# EAGLE design core (EAGLE 6.4)
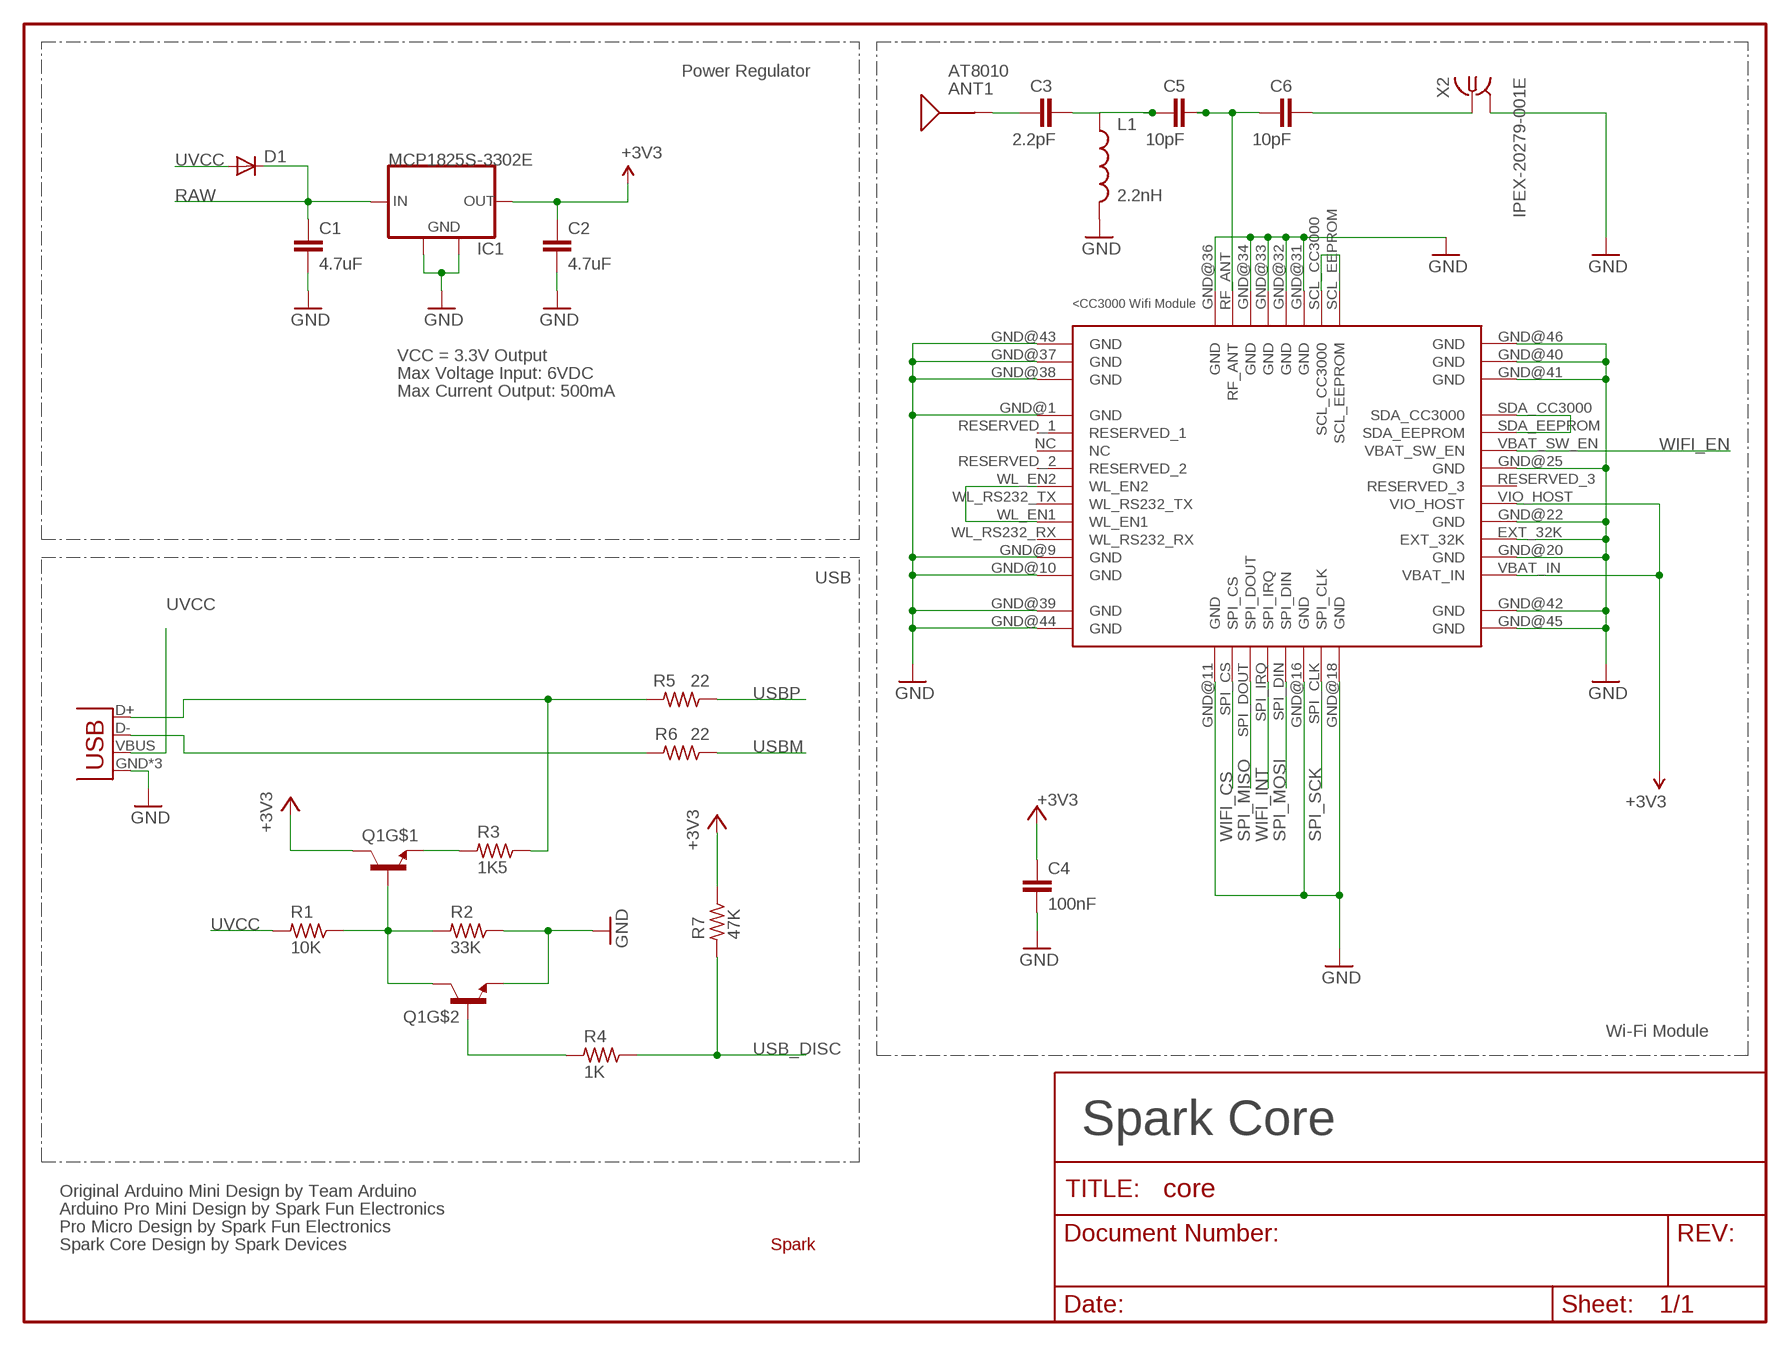
[diagram p0: schematic, sheet 1, part 1 of 2]
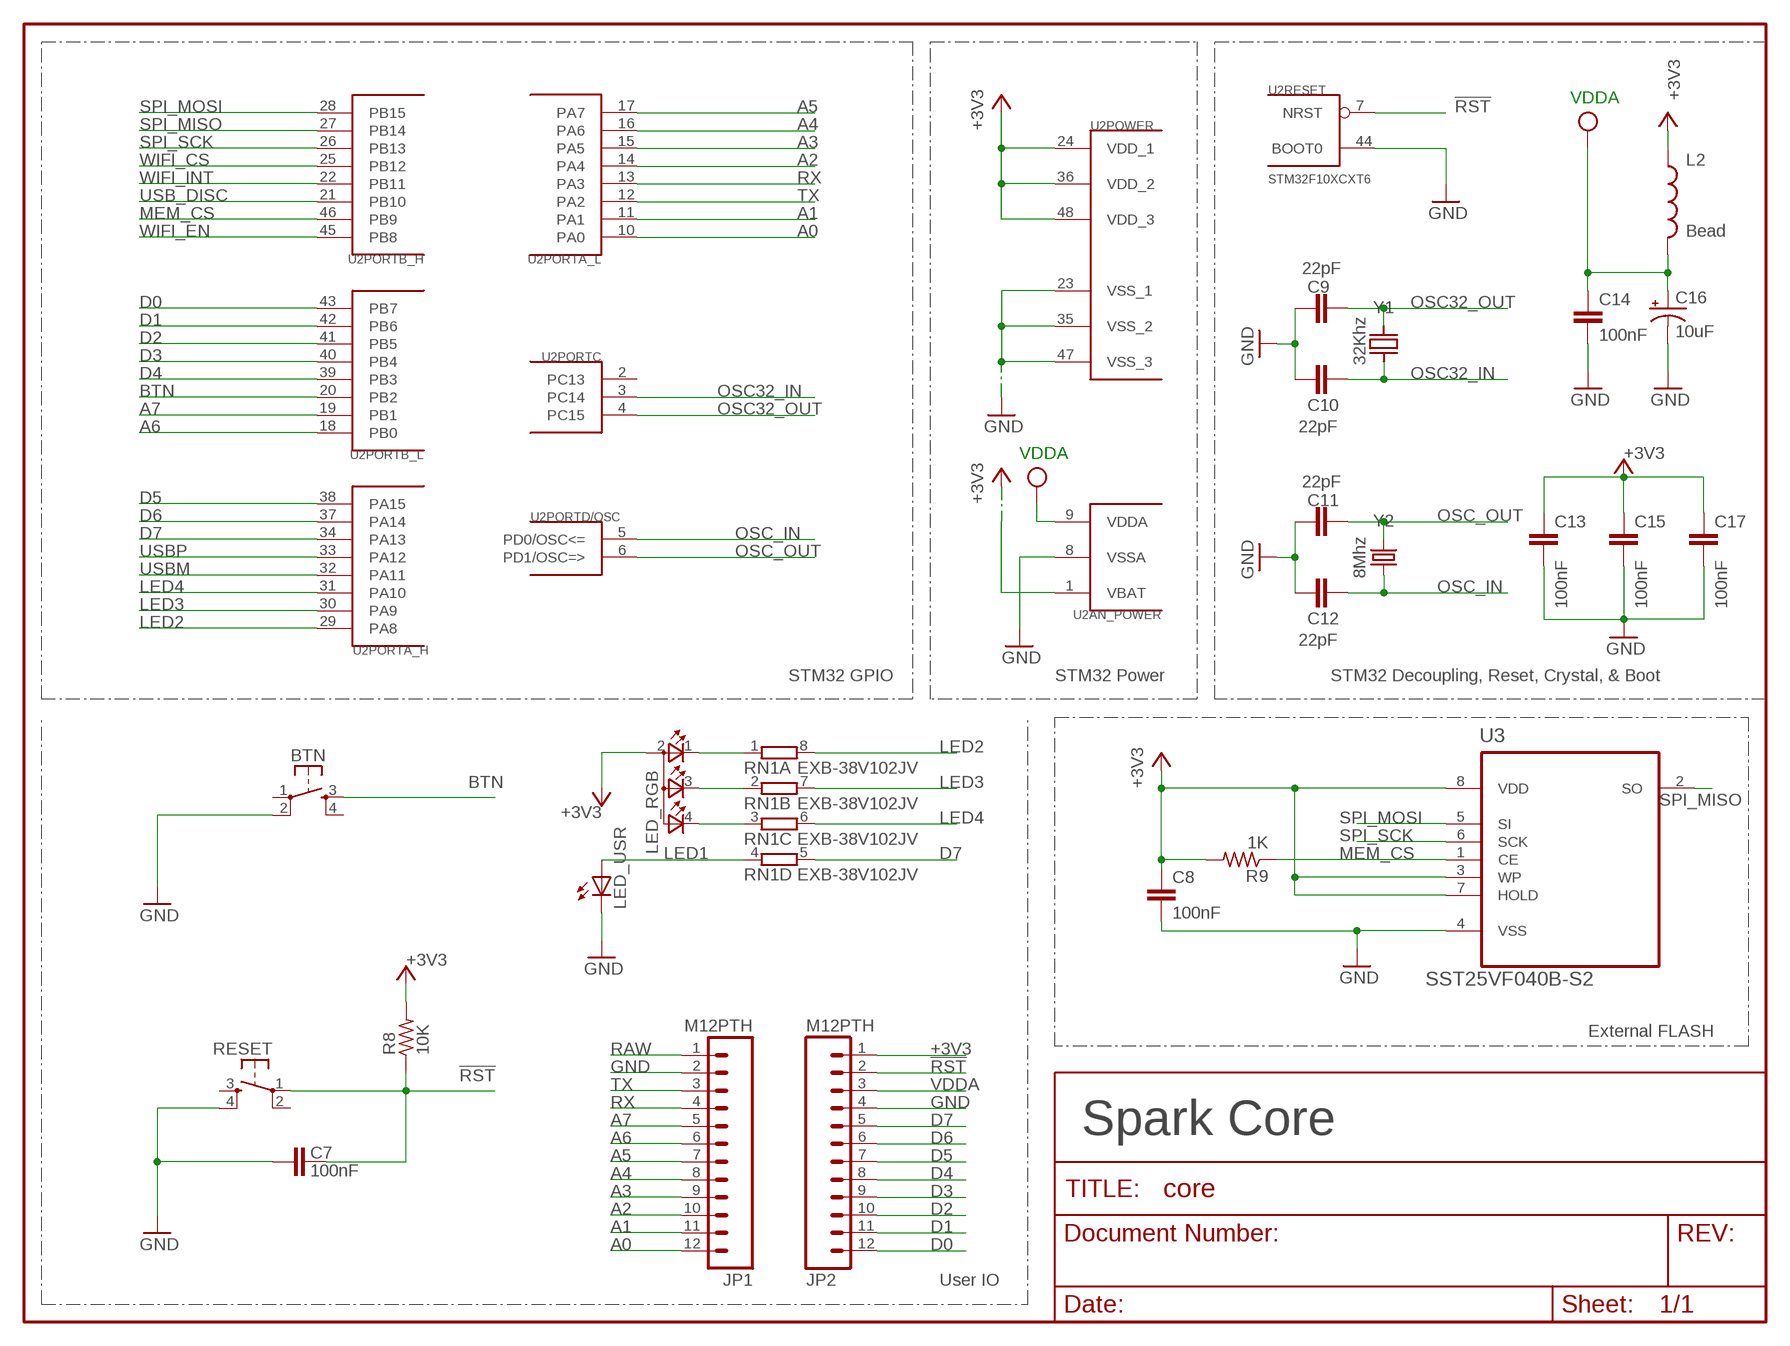
[diagram p1: schematic, sheet 1, part 2 of 2]

## Parts
ANT1  AT8010  [AT8010]
BTN  KMR211GLFS  TAC_SWITCHSMD  [TACTILE_SWITCH_SMD]
C1  4.7uF  C-EUC0603  [C0603]
C2  4.7uF  C-EUC0603  [C0603]
C3  2.2pF  C-EUC0603  [C0603]
C4  100nF  C-EUC0603  [C0603]
C5  10pF  C-EUC0603  [C0603]
C6  10pF  C-EUC0603  [C0603]
C7  100nF  C-EUC0603  [C0603]
C8  100nF  C-EUC0603  [C0603]
C9  22pF  C-EUC0603  [C0603]
C10  22pF  C-EUC0603  [C0603]
C11  22pF  C-EUC0603  [C0603]
C12  22pF  C-EUC0603  [C0603]
C13  100nF  C-EUC0603  [C0603]
C14  100nF  C-EUC0603  [C0603]
C15  100nF  C-EUC0603  [C0603]
C16  10uF  TANT-CAP1206  [EIA3216]
C17  100nF  C-EUC0603  [C0603]
D1  DIODESOD  [SOD-323]
IC1  MCP1825S-3302E  MCP1825S-SOT223  [SOT223]
JP1  M12PTH  [1X12-SMALL-PADS]
JP2  M12PTH  [1X12-SMALL-PADS]
L1  2.2nH  INDUCTOR0603  [0603]
L2  Bead  INDUCTOR0603  [0603]
LED_RGB  TOPLED-3PLCC  [P-LCC-4-3]
LED_USR  LED0603  [LED-0603]
Q1  MMDT3904  [SOT363]
R1  10K  R-US_R0603  [R0603]
R2  33K  R-US_R0603  [R0603]
R3  1K5  R-US_R0603  [R0603]
R4  1K  R-US_R0603  [R0603]
R5  22  R-US_R0603  [R0603]
R6  22  R-US_R0603  [R0603]
R7  47K  R-US_R0603  [R0603]
R8  10K  R-US_R0603  [R0603]
R9  1K  R-US_R0603  [R0603]
RESET  KMR211GLFS  TAC_SWITCHSMD  [TACTILE_SWITCH_SMD]
RN1  EXB-38V102JV  4R-NEXB38V  [EXB38V]
U1  CC3000  [CC3000]
U2  STM32F10XCXT6  [TQFP48]
U3  SST25VF040B-S2  [SOIC127P790X216-8N]
U$1  SPARK_LOGO2  [SPARK_LOGO2]
X1  USB-MICROB  USBUSB-MICROB-SLOT-HOLE  [USB-MICROB-SLOT-HOLE]
X2  IPEX-20279-001E  [IPEX-20279-001E]
Y1  32Khz  Q_FC135  [FC135]
Y2  8Mhz  CRYSTAL5X3  [CRYSTAL-SMD-5X3]

## Nets
!RST: C7.2 JP2.2 R8.1 RESET.1 U2.7(RESET:NRST)
+3V3: C2.1 C4.1 C8.1 C13.1 C15.1 C17.1 IC1.3(OUT) JP2.1 L2.1 LED_RGB.2(A2) Q1.3(C) R7.1 R8.2 R9.2 U1.VBAT_IN U1.VIO_HOST U2.1(AN_POWER:VBAT) U2.24(POWER:VDD_1) U2.36(POWER:VDD_2) U2.48(POWER:VDD_3) U3.3(WP) U3.7(HOLD) U3.8(VDD)
A0: JP1.12 U2.10(PORTA_L:PA0)
A1: JP1.11 U2.11(PORTA_L:PA1)
A2: JP1.10 U2.14(PORTA_L:PA4)
A3: JP1.9 U2.15(PORTA_L:PA5)
A4: JP1.8 U2.16(PORTA_L:PA6)
A5: JP1.7 U2.17(PORTA_L:PA7)
A6: JP1.6 U2.18(PORTB_L:PB0)
A7: JP1.5 U2.19(PORTB_L:PB1)
BTN: BTN.3 U2.20(PORTB_L:PB2)
D0: JP2.12 U2.43(PORTB_L:PB7)
D1: JP2.11 U2.42(PORTB_L:PB6)
D2: JP2.10 U2.41(PORTB_L:PB5)
D3: JP2.9 U2.40(PORTB_L:PB4)
D4: JP2.8 U2.39(PORTB_L:PB3)
D5: JP2.7 U2.38(PORTA_H:PA15)
D6: JP2.6 U2.37(PORTA_H:PA14)
D7: JP2.5 RN1.5 U2.34(PORTA_H:PA13)
GND [vcc]: BTN.2 C1.2 C2.2 C4.2 C7.1 C8.2 C9.2 C10.2 C11.2 C12.2 C13.2 C14.2 C15.2 C16.C(-) C17.2 IC1.2(GND) IC1.4(GND) JP1.2 JP2.4 L1.2 LED_USR.C Q1.1(E) R2.1 RESET.4 U1.EXT_32K U1.GND@1(GND) U1.GND@9(GND) U1.GND@10(GND) U1.GND@11(GND) U1.GND@16(GND) U1.GND@18(GND) U1.GND@20(GND) U1.GND@22(GND) U1.GND@25(GND) U1.GND@31(GND) U1.GND@32(GND) U1.GND@33(GND) U1.GND@34(GND) U1.GND@36(GND) U1.GND@37(GND) U1.GND@38(GND) U1.GND@39(GND) U1.GND@40(GND) U1.GND@41(GND) U1.GND@42(GND) U1.GND@43(GND) U1.GND@44(GND) U1.GND@45(GND) U1.GND@46(GND) U2.8(AN_POWER:VSSA) U2.23(POWER:VSS_1) U2.35(POWER:VSS_2) U2.44(RESET:BOOT0) U2.47(POWER:VSS_3) U3.4(VSS) X1.GND X1.MT1(GND) X1.MT2(GND) X2.2@1(GND) X2.2@2(GND)
LED1: LED_USR.A RN1.4
LED2: RN1.8 U2.29(PORTA_H:PA8)
LED3: RN1.7 U2.30(PORTA_H:PA9)
LED4: RN1.6 U2.31(PORTA_H:PA10)
MEM_CS: R9.1 U2.46(PORTB_H:PB9) U3.1(CE)
N$1: R3.1 R5.2 X1.D+
N$2 [RF]: C6.2 X2.1
N$3 [RF]: ANT1.SIG(SIGNAL) C3.1
N$4 [RF]: C5.2 C6.1 U1.RF_ANT
N$5 [RF]: C3.2 C5.1 L1.1
N$6: R6.2 X1.D-
N$7: U1.SCL_CC3000 U1.SCL_EEPROM
N$8: Q1.2(B) R4.2
N$9: U1.WL_EN1 U1.WL_EN2
N$10: LED_RGB.1(CRED) RN1.1
N$12: LED_RGB.3(CBLUE) RN1.2
N$13: Q1.5(B) Q1.6(C) R1.1 R2.2
N$14: LED_RGB.4(CGREEN) RN1.3
N$15: U1.SDA_CC3000 U1.SDA_EEPROM
N$16: Q1.4(E) R3.2
OSC32_IN: C10.1 U2.3(PORTC:PC14) Y1.X1
OSC32_OUT: C9.1 U2.4(PORTC:PC15) Y1.X2
OSC_IN: C12.1 U2.5(PORTD/OSC:PD0/OSC<=) Y2.1
OSC_OUT: C11.1 U2.6(PORTD/OSC:PD1/OSC=>) Y2.3
RAW [vcc]: C1.1 D1.1(C) IC1.1(IN) JP1.1
RX: JP1.4 U2.13(PORTA_L:PA3)
SPI_MISO: U1.SPI_DOUT U2.27(PORTB_H:PB14) U3.2(SO)
SPI_MOSI: U1.SPI_DIN U2.28(PORTB_H:PB15) U3.5(SI)
SPI_SCK: U1.SPI_CLK U2.26(PORTB_H:PB13) U3.6(SCK)
TX: JP1.3 U2.12(PORTA_L:PA2)
USB_DISC: R4.1 R7.2 U2.21(PORTB_H:PB10)
USBM: R6.1 U2.32(PORTA_H:PA11)
USBP: R5.1 U2.33(PORTA_H:PA12)
UVCC: D1.2(A) R1.2 X1.VBUS
VDDA: C14.1 C16.A(+) JP2.3 L2.2 U2.9(AN_POWER:VDDA) ; supply symbol labelled VCC
WIFI_CS: U1.SPI_CS U2.25(PORTB_H:PB12)
WIFI_EN: U1.VBAT_SW_EN U2.45(PORTB_H:PB8)
WIFI_INT: U1.SPI_IRQ U2.22(PORTB_H:PB11)
Unconnected: BTN.1 BTN.4 RESET.2 RESET.3 U1.NC U1.RESERVED_1 U1.RESERVED_2 U1.RESERVED_3 U1.WL_RS232_RX U1.WL_RS232_TX U2.2(PORTC:PC13)

## Notes on the sheet
- Power Regulator
- VDDA
- VCC = 3.3V Output
- Max Voltage Input: 6VDC
- Max Current Output: 500mA
- VDDA
- USB
- STM32 GPIO | STM32 Power | STM32 Decoupling, Reset, Crystal, & Boot
- Wi-Fi Module | External FLASH
- Spark Core | Spark Core
- Original Arduino Mini Design by Team Arduino
- Arduino Pro Mini Design by Spark Fun Electronics
- Pro Micro Design by Spark Fun Electronics
- Spark Core Design by Spark Devices
- User IO

## Library data of the parts
ANT1 = Spark:AT8010: AT8010 Series Multilayer Chip Antenna
BTN RESET = Spark:TAC_SWITCH: SMD Tactiile Switch
C1-C15 C17 = rcl:C-EU: CAPACITOR, European symbol
C16 = Spark:TANT-CAP: Tantalum SMT
D1 = SparkFun:DIODE: Diode These are standard reverse protection diodes and small signal diodes. SMA package can handle up to about 1A. SOD-323 can handle about 200mA. What the SOD-323 package when ordering, there are some mfgs out there that are 5-pin packages.
IC1 = Spark:MCP1825S: 500 mA, Low Voltage, Low Quiescent Current LDO Regulator
JP1 JP2 = Spark:M12: Header 12 Standard 12-pin 0.1" header. Use with straight break away headers (SKU : PRT-00116), right angle break away headers (PRT-00553), swiss pins (PRT-00743), machine pins (PRT-00117), and female headers (PRT-00115).
L1 L2 = SparkFun-Passives:INDUCTOR: Inductors Basic Inductor/Choke - 0603 and 1206. Footprints are not proven and vary greatly between part numbers. SRN6045- 33uH, 20% 1.4A
LED_RGB = Spark:TOPLED-3: Cree CLVBA-FKA
LED_USR = SparkFun:LED: LEDs Standard schematic elements and footprints for 5mm, 3mm, 1206, and 0603 sized LEDs. 5mm - Spark Fun Electronics SKU : COM-00529 (and others)
Q1 = SparkFun-DiscreteSemi:MMDT3904: Dual NPN transistor
R1-R9 = rcl:R-US_: RESISTOR, American symbol
RN1 = resistor-dil:4R-N: Array Chip Resistor Source: RS Component / Phycomp; OC_FARNELL: unknown; OC_NEWARK: unknown
U1 = CC3000:CC3000
U2 = stm32:STM32F10XCXT6: ST STM32F101/103 48pin LQFP
U3 = Spark:SST25VF040B: 4 Mbit SPI Serial Flash
U$1 = Spark:SPARK_LOGO2
X1 = Spark:USB
X2 = Spark:IPEX-20279-001E: Ultra Miniature Coaxial SMT RF Receptacle
Y1 = Spark:Q
Y2 = SparkFun-FreqCtrl:CRYSTAL: Various standard crystals. Proven footprints. Spark Fun Electronics SKU : COM-00534

## Net classes
2 RF: width 0.635 mm, clearance 0.762 mm

## Board
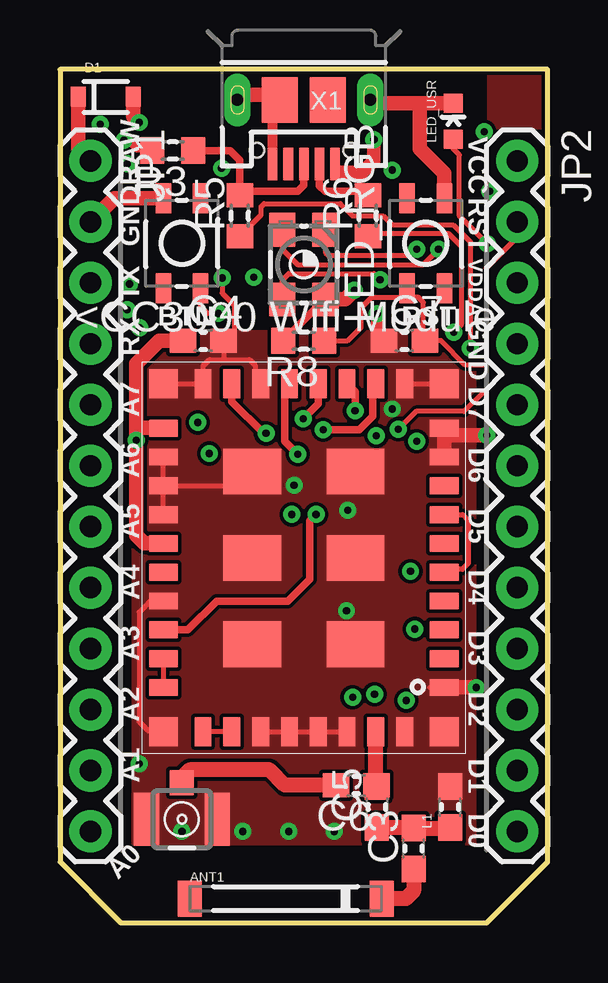
[diagram p2: board, top side]
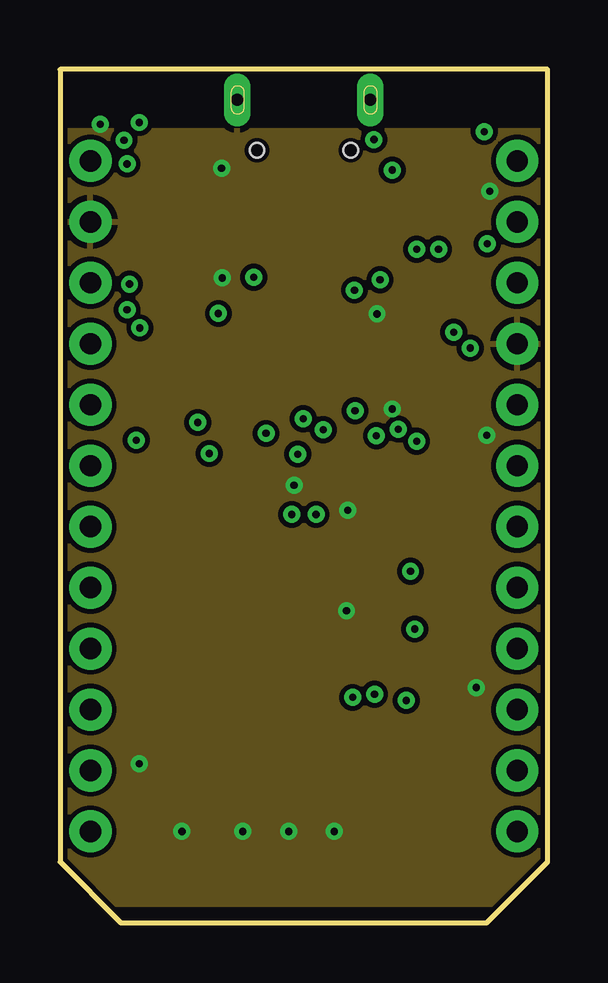
[diagram p3: board, inner layer $GND]
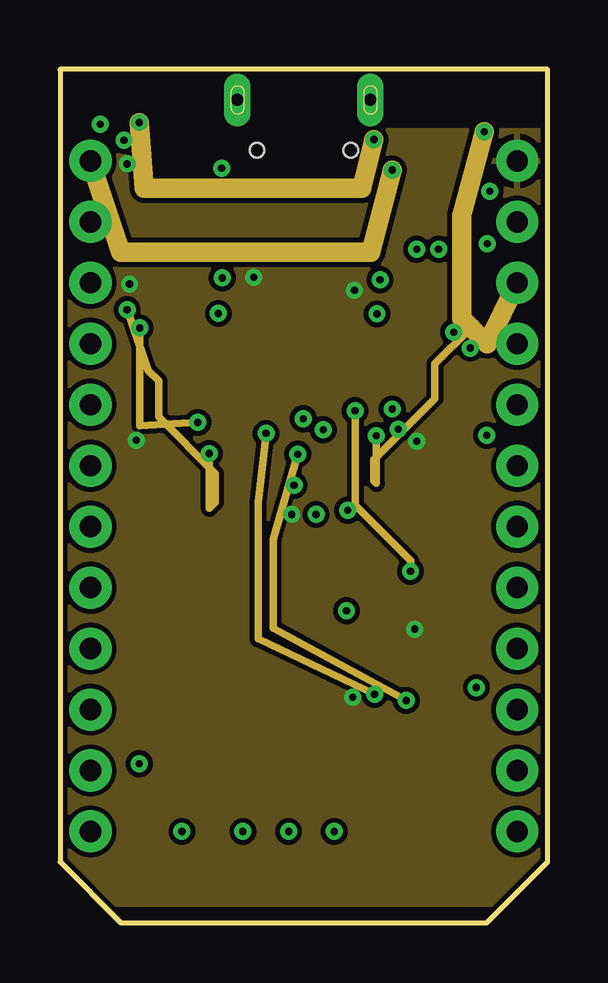
[diagram p4: board, inner layer $+3V3]
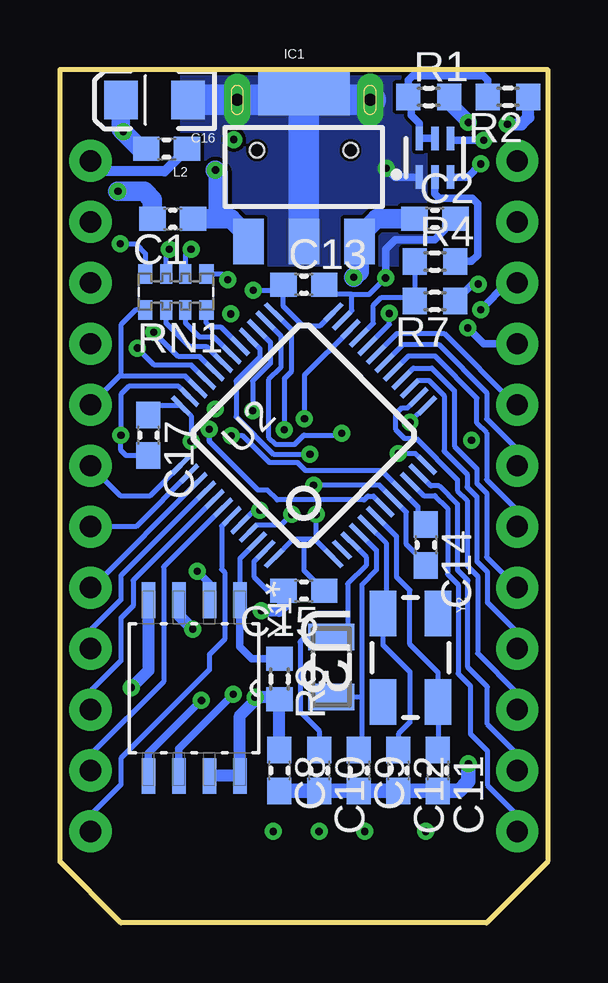
[diagram p5: board, bottom side, seen from below]

Size 20.32 x 35.56 mm. Coordinates in mm from the lower left corner, seen from the top.
Outline: 0,35.56 0,2.54 2.54,0 17.78,0 20.32,2.54 20.32,35.56 0,35.56
Copper layers (1+2*15+16): Top 0.035mm / dielectric 1.5mm / $GND 0.035mm / dielectric 0.15mm / $+3V3 0.035mm / dielectric 0.2mm / Bottom 0.035mm
Design rules "spark": minimum track width 6mil, minimum drill 0.3mm, track to track 6mil, track to pad 6mil, pad to pad 6mil, via to via 6mil, smd to smd 6mil, copper to edge 6mil, drill to drill 6mil, minimum pad ring 12mil, minimum via ring 8mil, stop-mask expansion 4mil, vias tented up to drill 20mil, thermal gap 10mil

### Footprints (pad centres in the part's own frame; a part is rotated, then mirrored left to right if it is on the bottom)
AT8010 = smd 1 x 1.5: NC -4,0; SIG 4,0
TACTILE_SWITCH_SMD = smd 1.25 x 0.65: 1 -1.875,0.775; 2 1.875,0.775; 3 -1.875,-0.775; 4 1.875,-0.775
C0603 = smd 1.1 x 1: 1 -0.85,0; 2 0.85,0
EIA3216 = smd 1.4 x 1.6: A 1.4,0; C -1.4,0
SOD-323 = smd 0.63 x 0.83: 1 -1.15,0; 2 1.15,0
SOT223 = smd 1.27 x 1.905: 1 -2.311,-3.099; 2 0,-3.099; 3 2.311,-3.099 | smd 3.81 x 1.905: 4 0,3.099
1X12-SMALL-PADS = drill 0.889 pad 1.753: 1 0,0; 2 2.54,0; 3 5.08,0; 4 7.62,0; 5 10.16,0; 6 12.7,0; 7 15.24,0; 8 17.78,0; 9 20.32,0; 10 22.86,0; 11 25.4,0; 12 27.94,0
0603 = smd 1.1 x 1: 1 -0.85,0; 2 0.85,0
P-LCC-4-3 = smd 1.1 x 1.4: 1 -0.9,-1.45; 2 0.9,-1.45; 3 0.9,1.45; 4 -0.9,1.45
LED-0603 = smd 0.8 x 0.8: A 0,-0.75; C 0,0.75
SOT363 = smd 0.3 x 0.99: 1 -0.65,-0.8; 2 0,-0.8; 3 0.65,-0.8; 4 0.65,0.81; 5 0,0.81; 6 -0.65,0.81
R0603 = smd 1 x 1.1: 1 -0.85,0; 2 0.85,0
EXB38V = smd 0.6 x 0.8: 1 -1.275,-0.75; 4 1.275,-0.75; 5 1.275,0.75; 8 -1.275,0.75 | smd 0.5 x 0.8: 2 -0.4,-0.75; 3 0.4,-0.75; 6 0.4,0.75; 7 -0.4,0.75
CC3000 = smd 1.2 x 0.7: EXT_32K 5.85,-2.97; GND@1 -5.85,5.43; GND@9 -5.85,-4.17; GND@10 -5.85,-5.37; GND@20 5.85,-4.17; GND@22 5.85,-1.77; GND@25 5.85,1.83; NC -5.85,3.03; RESERVED_1 -5.85,4.23; RESERVED_2 -5.85,1.83; RESERVED_3 5.85,0.63; SDA_CC3000 5.85,5.43; SDA_EEPROM 5.85,4.23; VBAT_IN 5.85,-5.37; VBAT_SW_EN 5.85,3.03; VIO_HOST 5.85,-0.57; WL_EN1 -5.85,-1.77; WL_EN2 -5.85,0.63; WL_RS232_RX -5.85,-2.97; WL_RS232_TX -5.85,-0.57 | smd 0.7 x 1.2: GND@11 -4.2,-7.22; GND@16 1.8,-7.22; GND@18 4.2,-7.22; GND@31 1.8,7.28; GND@32 0.6,7.28; GND@33 -0.6,7.28; GND@34 -1.8,7.28; GND@36 -4.2,7.28; RF_ANT -3,7.28; SCL_CC3000 3,7.28; SCL_EEPROM 4.2,7.28; SPI_CLK 3,-7.22; SPI_CS -3,-7.22; SPI_DIN 0.6,-7.22; SPI_DOUT -1.8,-7.22; SPI_IRQ -0.6,-7.22 | smd 2.4 x 1.9: GND@37 -2.15,3.63; GND@38 -2.15,0.03; GND@39 -2.15,-3.57; GND@40 2.15,3.63; GND@41 2.15,0.03; GND@42 2.15,-3.57 | smd 1.2 x 1.2: GND@43 -5.85,7.28; GND@44 -5.85,-7.22; GND@45 5.85,-7.22; GND@46 5.85,7.28
TQFP48 = smd 0.2 x 1: 1 -2.75,-4.5; 2 -2.25,-4.5; 3 -1.75,-4.5; 4 -1.25,-4.5; 5 -0.75,-4.5; 6 -0.25,-4.5; 7 0.25,-4.5; 8 0.75,-4.5; 9 1.25,-4.5; 10 1.75,-4.5; 11 2.25,-4.5; 12 2.75,-4.5; 25 2.75,4.5; 26 2.25,4.5; 27 1.75,4.5; 28 1.25,4.5; 29 0.75,4.5; 30 0.25,4.5; 31 -0.25,4.5; 32 -0.75,4.5; 33 -1.25,4.5; 34 -1.75,4.5; 35 -2.25,4.5; 36 -2.75,4.5 | smd 1 x 0.2: 13 4.5,-2.75; 14 4.5,-2.25; 15 4.5,-1.75; 16 4.5,-1.25; 17 4.5,-0.75; 18 4.5,-0.25; 19 4.5,0.25; 20 4.5,0.75; 21 4.5,1.25; 22 4.5,1.75; 23 4.5,2.25; 24 4.5,2.75; 37 -4.5,2.75; 38 -4.5,2.25; 39 -4.5,1.75; 40 -4.5,1.25; 41 -4.5,0.75; 42 -4.5,0.25; 43 -4.5,-0.25; 44 -4.5,-0.75; 45 -4.5,-1.25; 46 -4.5,-1.75; 47 -4.5,-2.25; 48 -4.5,-2.75
SOIC127P790X216-8N = smd 1.499 x 0.559: 1 -3.658,1.905; 2 -3.658,0.635; 3 -3.658,-0.635; 4 -3.658,-1.905; 5 3.658,-1.905; 6 3.658,-0.635; 7 3.658,0.635; 8 3.658,1.905
USB-MICROB-SLOT-HOLE = smd 0.4 x 1.35: D+ 0,2.675; D- -0.65,2.675; GND 1.3,2.675; ID 0.65,2.675; VBUS -1.3,2.675 | drill 0.5 pad 1.1 long: MT1 -2.775,0; MT2 2.775,0 | smd 1.5 x 1.9: P$1 -1,0; P$2 1,0.01 | hole 0.6: -1.95,2.1; 1.95,2.1
IPEX-20279-001E = smd 1 x 1.05: 1 0,1.528 | smd 1.05 x 2.2: 2@1 -1.475,0; 2@2 1.475,0
FC135 = smd 1.1 x 1.9: X1 -1.25,0; X2 1.25,0
CRYSTAL-SMD-5X3 = smd 1.9 x 1.1: 1 -1.85,-1.15; 2 1.85,-1.15; 3 1.85,1.15; 4 -1.85,1.15

### Placement (x,y rotation side)
ANT1  9.4,1.02 0 top
BTN  5.08,28.32 90 top
C1  15.62,29.34 180 bottom
C2  4.7,29.34 0 bottom
C3  14.73,3.1 90 top
C4  5.97,24.26 0 top
C5  13.21,4.83 90 top
C6  12.34,5.74 180 top
C7  14.35,24.26 0 top
C8  11.18,6.35 270 bottom
C9  7.87,6.35 270 bottom
C10  9.53,6.35 270 bottom
C11  4.57,6.35 270 bottom
C12  6.22,6.35 270 bottom
C13  10.16,26.59 0 bottom
C14  5.08,15.75 270 bottom
C15  10.16,13.84 180 bottom
C16  16.38,34.29 180 bottom
C17  16.64,20.32 270 bottom
D1  1.91,34.42 0 top
IC1  10.16,31.5 0 bottom
JP1  1.27,31.75 270 top
JP2  19.05,31.75 270 top
L1  16.26,4.83 90 top
L2  15.88,32.26 180 bottom
LED_RGB  10.16,27.43 0 top
LED_USR  16.38,33.4 0 top
Q1  4.7,31.88 0 bottom
R1  4.95,34.42 0 bottom
R2  1.65,34.42 180 bottom
R3  4.7,32.18 180 top
R4  4.7,27.56 0 bottom
R5  7.49,29.46 90 top
R6  12.83,29.46 90 top
R7  4.7,25.91 180 bottom
R8  10.16,24.26 180 top
R9  11.18,10.16 270 bottom
RESET  15.24,28.32 90 top
RN1  15.49,26.29 180 bottom
U1  10.16,15.24 180 top
U2  10.16,20.32 45 bottom
U3  14.73,9.78 270 bottom
U$1  17.78,33.02 0 top
X1  10.16,34.29 180 top
X2  5.08,4.32 0 top
Y1  9.02,10.67 270 bottom
Y2  5.71,11.05 270 bottom

### Tracks (layer width: path | path; a pad name or v marks a point on that pad's centre or on a via)
!RST  (via drill 0.3)
  Top 0.203: 17.75,24.08 17.75,27.28 19.05,28.57 JP2.2 | 17.75,24.08 17.75,23.24 | 17.75,23.24 17.75,22.23 16.84,21.31 14.83,21.31 v14.1,20.57 | 17.73,24.11 17.75,24.08 | R8.1 11.99,24.26 12.55,24.82 12.55,25.63 12.98,26.06 14.46,26.06 | 14.46,26.06 14.94,26.06 15.14,25.86 15.14,24.32 C7.2 15.88,24.26 16.89,23.24 17.75,23.24 | 14.46,26.06 RESET.1 | 17.78,23.24 17.75,23.24
  Bottom 0.203: 14.1,20.17 v14.1,20.57 14.1,20.07 12.06,18.03 11.68,18.03 11.28,17.63 7.64,17.63 7.49,17.78 7.27,17.78 U2.7
+3V3  (via drill 0.3)
  Top 0.305: R8.2 11.04,25.98 LED_RGB.2
  Top 0.61: U1.VIO_HOST 3.52,15.81 3.17,16.15 v3.17,20.12 3.17,20.62 | 3.17,20.62 3.17,23.29 4.14,24.26 C4.1 | U1.VBAT_IN 4.29,20.62 3.17,20.62 | LED_RGB.2 11.88,25.98 v12.27,26.36
  Bottom 0.203: U2.1 9.71,15.98 | 9.71,15.98 10.16,15.98 | 10.16,15.98 10.62,15.98 U2.48 | 10.16,15.98 10.16,14.69 C15.1 | U2.24 9.5,24.87 10.19,24.87 11.01,25.69 C13.1 11.24,26.36 v12.27,26.36 | C17.1 16.25,21.56 U2.36 14.86,21.13 v14.86,20.07 | 9.71,15.98 9.65,16.03 v9.65,17.02
  Bottom 0.305: R7.1 3.14,26.62 v2.9,26.62 | Q1.3 3.34,31.08 v2.79,31.62
  Bottom 0.406: L2.1 15.96,31.32 18.62,31.32 JP2.1
  Bottom 0.508: U3.7 U3.8 12.83,8.64 12.19,9.27 v12.19,9.4 11.6,9.4 11.34,9.14 R9.2 C8.1 | v14.78,12.24 15.37,12.83 U3.3
  Bottom 0.813: C2.1 7.11,29.34 7.85,28.6 IC1.3 7.85,27.13 v8.08,26.9
  pour $+3V3 (isolate 0.203): 0,33.02 20.32,33.02 20.32,0.76 0,0.76
A0
  Bottom 0.203: U2.10 5.17,17.8 4.7,17.8 4.17,17.27 4.17,14.53 3.73,14.1 3.73,10.39 3.23,9.88 3.23,7.87 2.52,7.16 2.52,5.74 1.27,4.5 JP1.12
A1
  Bottom 0.203: U2.11 4.87,18.21 4.52,18.21 3.76,17.45 3.76,14.71 3.33,14.28 3.33,10.64 2.52,9.83 2.52,8.28 1.27,7.04 JP1.11
A2
  Bottom 0.203: JP1.10 1.27,9.58 2.92,11.23 2.92,14.45 3.35,14.88 3.35,17.6 3.76,18.01 3.76,18.47 5.49,20.19 5.97,20.19 6.35,20.57 6.35,21.18 6.07,21.46 5.84,21.46 U2.14
A3
  Bottom 0.203: U2.15 5.4,22.61 4.95,22.61 4.32,21.97 4.32,19.66 3.35,18.69 3.35,18.16 2.95,17.75 2.95,15.06 2.52,14.63 2.52,13.36 1.27,12.12 JP1.9
A4
  Bottom 0.203: U2.16 5.6,23.11 4.83,23.11 3.89,22.17 3.89,19.86 2.95,18.92 2.95,18.31 2.54,17.91 2.54,15.24 JP1.8
A5
  Bottom 0.203: U2.17 5.8,23.62 4.7,23.62 2.95,21.87 2.95,20.83 2.54,20.42 2.54,18.47 1.27,17.2 JP1.7
A6
  Bottom 0.203: U2.18 6.02,24.11 4.55,24.11 2.54,22.1 2.54,21.01 1.27,19.74 JP1.6
A7
  Bottom 0.203: U2.19 6.27,24.56 4.32,24.56 1.35,21.59 JP1.5
BTN  (via drill 0.3)
  Top 0.203: 5.84,26.43 BTN.3 5.87,26.43 5.87,25.65 6.13,25.39 v6.6,25.39
  Bottom 0.203: U2.20 6.6,24.94 v6.6,25.39
D0
  Bottom 0.203: JP2.12 19.05,4.5 17.78,5.77 17.78,6.86 14.1,10.54 14.1,11.18 13.46,11.81 13.46,14.61 13.59,14.73 13.59,16.54 U2.43
D1
  Bottom 0.203: U2.42 16,14.83 16,10.06 19.05,7.01 JP2.11
D2
  Bottom 0.203: U2.41 17.27,14.27 17.27,13.21 17.78,12.7 17.78,10.92 19.05,9.65 JP2.10
D3
  Bottom 0.203: U2.40 17.77,14.48 17.78,14.48 17.78,13.46 19.05,12.19 JP2.9
D4
  Bottom 0.203: U2.39 18.98,13.97 JP2.8
D5
  Bottom 0.203: U2.38 17.15,16.51 JP2.7
D6
  Bottom 0.203: U2.37 16.59,17.78 17.78,17.78 JP2.6
D7
  Bottom 0.203: U2.34 15.1,22.78 17.86,22.78 | RN1.5 17.16,25.54 17.78,24.92 17.78,22.86 17.86,22.78 | 17.86,22.78 JP2.5
GND  (via drill 0.3)
  Top 0.203: U1.GND@43 16.01,8.12 | U1.GND@1 15.4,9.81 | U1.GND@34 U1.GND@33 U1.GND@32 U1.GND@31 8.36,8.4 | U1.GND@22 U1.EXT_32K | U1.GND@45 U1.GND@18 | U1.GND@38 12.41,15.11 | U1.GND@25 4.49,13.59 3.94,13.59 3.3,12.95 3.3,8.38 3.68,8 4.27,8 U1.GND@46 | U1.GND@11 U1.GND@44 | U1.EXT_32K U1.GND@20 | U1.EXT_32K 7.41,18.21 U1.GND@42 | U1.GND@18 | 8.26,21.97 8.26,22.36 U1.GND@16 8.13,22.69 8.13,23.24 7.9,23.47 6.83,23.47 | U1.GND@18 5.96,23.21 6.22,23.47 6.83,23.47 | 6.83,23.47 6.82,23.48 C4.2 7.26,24.7 7.26,25.73 6.76,26.24 v6.76,26.87 | 12.06,17.27 12.06,17.4
  Top 0.406: X1.GND 8.86,34.51
  Top 0.508: v13.21,25.38 13.21,24.55 C7.1
  Top 0.61: U1.GND@1 v17.34,9.81 v17.35,9.8 | U1.GND@9 U1.GND@10 16.3,20.32 v17.78,20.32 | RESET.4 16.02,31.23 14.99,32.26 14.99,34.15 | LED_USR.C 14.99,34.15 | 14.99,34.15 13.07,34.15 X1.MT1 | BTN.2 2.26,30.2 JP1.2 | 8.86,34.51 7.61,34.51 X1.MT2
  Bottom 0.203: U2.35 15.37,22.35 17.45,22.35 17.78,22.02 v17.78,20.32 17.78,19.68 17.57,19.47 C17.2 | U2.47 12.24,15.05 12.24,14.43 11.66,13.84 C15.2 | 8.15,26.19 7.44,26.19 v6.76,26.87 | U2.23 8.15,25.51 8.15,26.19 | C14.2 5.08,14.96 5.89,15.77 5.89,17.11 U2.8 7.02,18.24 v9.75,18.24 | 8.15,26.19 8.9,26.19 C13.2 | U2.44 12.22,17.2 v11.99,17.2
  Bottom 0.305: 10.16,34.67 IC1.4 | Q1.1 6.36,31.08 v6.73,31.45 | C2.2 4.71,28.47 6.35,28.47 6.76,28.07 v6.76,26.87
  Bottom 0.508: U3.4 16.64,10.52 v17.35,9.8 | v11.94,13.01 11.2,13.01 11.01,13.2 C15.2 | v1.68,33.27 1.09,33.27 0.8,33.56 R2.1 0.81,34.41
  Bottom 0.61: C8.2 C10.2 C9.2 C12.2 C11.2 3.69,5.5 3.3,5.89 v3.3,6.63
  Bottom 0.813: C1.2 16.47,30.14 16.82,30.48 v17.91,30.48 | 10.16,34.8 IC1.4
  Bottom 1.27: IC1.2 IC1.4 | 7.37,34.29 X1.MT1 C16.C
  other vias: 5.08,3.81 7.62,3.81 9.53,3.81 11.43,3.81 13.84,21.41
  pour $GND (isolate 0.203): 0,33.02 20.32,33.02 20.32,0.76 0,0.76
  pour Top (no thermals): 3.05,3.3 3.05,24.64 17.27,24.64 17.27,3.3
  pour Bottom (no thermals): 5.08,35.56 15.24,35.56 15.24,27.43 5.08,27.43
LED1  (via drill 0.3)
  Top 0.203: v17.8,28.3 16.64,29.46 16.64,32 16.38,32.26 LED_USR.A
  Bottom 0.203: v17.8,28.3 17.17,28.3 16.76,27.89 RN1.4
LED2
  Bottom 0.203: U2.29 13.6,24.82 14.05,24.82 14.22,24.99 RN1.8
LED3
  Bottom 0.203: U2.30 13.9,24.41 14.5,24.41 15.09,24.99 RN1.7
LED4
  Bottom 0.203: U2.31 14.2,24 14.91,24 15.9,24.99 RN1.6
MEM_CS
  Bottom 0.203: U2.46 12.83,15.18 U3.1
  Bottom 0.305: U3.1 12.83,11.51 12.33,11.01 R9.1
N$1
  Top 0.305: R3.1 7.09,32.18 7.49,31.77 R5.2 7.66,30.48 9.91,30.48 10.16,30.73 X1.D+
N$2
  Top 0.635: C6.2 9.37,5.74 8.74,6.38 5.4,6.38 5.08,6.06 X2.1
N$3
  Top 0.635: C3.1 14.73,1.33 14.41,1.02 ANT1.SIG
N$4
  Top 0.406: 13.21,5.74 C6.1
  Top 0.635: C6.1 13.16,5.78 U1.RF_ANT | 13.21,5.74 C5.2
N$5
  Top 0.635: C5.1 14.71,3.98 C3.2 16.23,3.95 L1.1
N$6
  Top 0.305: X1.D- 10.81,30.72 11.05,30.48 12.66,30.48 R6.2
N$7
  Top 0.203: U1.SCL_CC3000 U1.SCL_EEPROM
N$8
  Bottom 0.305: Q1.2 4.7,30.38 4.52,30.2 3.15,30.2 2.92,29.97 2.92,27.81 3.17,27.56 R4.2
N$9
  Top 0.203: U1.WL_EN1 16.77,17.01 17.02,16.76 17.02,14.99 16.76,14.73 16.13,14.73 U1.WL_EN2
N$10  (via drill 0.3)
  Top 0.203: LED_RGB.1 9.26,26.79 9.53,27.05 13.08,27.05 v13.34,26.8
  Bottom 0.203: RN1.1 13.58,27.04 v13.34,26.8
N$11
  pour Top: 17.91,35.56 20.32,35.56 20.32,33.15 17.91,33.15
N$12  (via drill 0.3)
  Top 0.203: LED_RGB.3 11.06,27.93 11.18,27.81 14.61,27.81 v14.86,28.07
  Bottom 0.203: v14.86,28.07 15.09,27.83 RN1.2
N$13
  Bottom 0.305: Q1.5 Q1.6 5.35,33.31 5.69,33.66 5.69,34.3 R1.1 5.8,35.12 5.61,35.31 2.69,35.31 2.5,35.12 R2.2
N$14  (via drill 0.3)
  Top 0.203: LED_RGB.4 9.26,28.08 9.91,27.43 15.14,27.43 v15.77,28.07
  Bottom 0.203: RN1.3 15.89,27.95 v15.77,28.07
N$15
  Top 0.203: U1.SDA_EEPROM U1.SDA_CC3000
N$16  (via drill 0.3)
  Top 0.305: 3.76,32.18 R3.2 3.77,32.26 3.2,32.26 2.85,32.61 v2.67,32.61
  Bottom 0.305: Q1.4 3.98,32.61 v2.67,32.61
OSC32_IN
  Bottom 0.203: U2.3 7.57,15.25 7.57,14.88 8.33,14.12 8.33,12.27 8.43,12.17 8.77,12.17 Y1.X1 10.1,11.92 10.31,11.71 10.31,8.79 9.53,8 C10.1
OSC32_OUT
  Bottom 0.203: U2.4 7.14,15.53 7.14,14.71 7.75,14.1 7.75,9.42 | 7.75,9.42 7.75,7.33 C9.1 | Y1.X2 7.75,9.42
OSC_IN
  Bottom 0.203: U2.5 6.73,15.83 6.73,13.03 Y2.1 6.87,11.59 5.74,10.46 5.74,8.36 6.22,7.87 C12.1
OSC_OUT
  Bottom 0.203: U2.6 6.3,16.11 6.3,14.43 5.74,13.87 5.74,11.61 4.57,10.43 Y2.3 | 4.57,9.21 Y2.3 | Y2.3 C11.1
RAW  (via drill 0.3)
  Top 0.61: D1.1 0.76,32.27 JP1.1
  $+3V3 0.813: v13.84,31.37 12.95,27.94 2.54,27.94 JP1.1
  Bottom 0.813: IC1.1 12.47,28.6 13.21,29.34 13.72,29.34 | 13.72,29.34 C1.1 | v13.84,31.37 13.72,31.24 13.72,29.34
RX  (via drill 0.3)
  $+3V3 0.305: v3.33,24.79 3.33,20.72 v5.74,20.85
  Bottom 0.203: U2.13 v5.74,20.85
  Bottom 0.305: v3.33,24.79 2.67,24.13 JP1.4
SPI_MISO  (via drill 0.3)
  Top 0.305: U1.SPI_DOUT 12.29,22.13 v12.29,21.34
  $+3V3 0.305: v12.29,21.34 12.29,17.4 14.61,15.09 v14.61,14.66
  Bottom 0.203: U2.27 11.56,24.19 11.56,23.32 12.29,22.58 v12.29,21.34
  Bottom 0.305: U3.2 14.1,14.15 v14.61,14.66
SPI_MOSI  (via drill 0.3)
  Top 0.305: U1.SPI_DIN 9.37,22.27 9.37,20.07 v9.91,19.53
  $+3V3 0.305: v14.43,9.27 8.89,12.27 8.89,15.98 v9.91,19.53
  Bottom 0.203: U2.28 11.99,23.92 11.99,23.57 12.98,22.58 12.98,21.08 11.43,19.53 v9.91,19.53
  Bottom 0.305: U3.5 16.64,7.06 v14.43,9.27
SPI_SCK  (via drill 0.3)
  Top 0.305: U1.SPI_CLK 7.16,21.72 8.48,20.4 v8.59,20.4
  $+3V3 0.305: v13.11,9.53 8.26,11.84 8.26,17.53 v8.59,20.4
  Bottom 0.203: U2.26 11.12,24.47 11.12,23.14 11.63,22.63 11.63,20.24 11.33,19.94 10.54,19.94 10.16,20.32 8.66,20.32 v8.59,20.4
  Bottom 0.305: U3.6 15.37,7.26 v13.11,9.53
TX  (via drill 0.3)
  $+3V3 0.305: v2.79,25.55 3.68,23.01 4.12,22.58 4.12,21.08 6.48,18.72 6.48,17.53 6.22,17.27 v6.22,19.56
  Bottom 0.203: U2.12 5.51,19.56 v6.22,19.56
  Bottom 0.305: v2.79,25.55 1.68,26.67 JP1.3
USB_DISC
  Bottom 0.203: U2.21 7.26,24.98 7.26,25.73 6.93,26.06 5.7,26.06 R7.2 R4.1
USBM  (via drill 0.3)
  Top 0.203: R6.1 12.94,28.73 16.18,28.73 16.71,28.19 16.71,24.92 v16.41,24.61
  Bottom 0.203: U2.32 14.5,23.6 15.39,23.6 v16.41,24.61
USBP  (via drill 0.3)
  Top 0.203: 7.42,28.54 R5.1 8.38,29.5 8.38,29.84 8.51,29.97 11.68,29.97 12.19,29.46 13.46,29.46 13.84,29.08 16.38,29.08 17.09,28.37 v17.09,23.95
  Bottom 0.203: U2.33 14.85,23.24 16.38,23.24 v17.09,23.95
UVCC  (via drill 0.3)
  Top 0.305: 11.46,31.52 X1.VBUS
  Top 0.406: 11.73,31.27 11.71,31.27 11.46,31.52
  Top 0.559: 11.73,31.27 12.6,31.27 13.08,31.75 v13.08,32.64
  Top 0.61: D1.2 3.06,33.6 v3.3,33.35
  $+3V3 0.813: v13.08,32.64 12.57,30.61 3.5,30.61 v3.3,33.35
  Bottom 0.61: v3.3,33.35 3.3,33.38 4.1,34.18 R1.2
VDDA  (via drill 0.3)
  $+3V3 0.305: 17.13,24.8 15.62,23.29 15.62,21.84 13.08,19.3 13.08,18.41 13.18,18.31 v13.18,20.3
  $+3V3 0.813: JP2.3 17.8,24.13 17.13,24.8 16.74,25.2 16.74,29.49 v17.68,32.97
  Bottom 0.203: C14.1 5.41,16.93 5.41,17.34 U2.9 6.92,18.85 10.08,18.85 10.41,19.18 11.58,19.18 12.7,20.3 v13.18,20.3
  Bottom 0.762: 17.8,34.27 C16.A 17.78,33.07 v17.68,32.97 16.97,32.26 L2.2 16.84,32.26
WIFI_CS  (via drill 0.3)
  Top 0.203: U1.SPI_CS 12.91,22.7
  Top 0.305: v10.97,20.55 12.47,20.55 13.03,21.11 13.03,22.33 U1.SPI_CS
  Bottom 0.203: U2.25 10.69,24.74 10.69,22.96 10.97,22.68 v10.97,20.55
WIFI_EN  (via drill 0.3)
  Top 0.203: 4.33,12.19 U1.VBAT_SW_EN
  Top 0.305: U1.VBAT_SW_EN 5.33,12.21 6.53,13.41 9.5,13.41 10.41,14.33 10.41,16.76 v10.67,17.02
  Bottom 0.203: U2.45 12.13,16.59 11.1,16.59 v10.67,17.02
WIFI_INT  (via drill 0.3)
  Top 0.305: v10.13,21.01 10.76,21.63 U1.SPI_IRQ
  Bottom 0.203: U2.22 10.13,22.82 v10.13,21.01

### Text on the board
tPlace: VCC | RAW | RST | GND | VDDA | TX | BTN | RST | GND | RX | D7 | A7 | D6 | A6 | D5 | A5 | D4 | A4 | D3 | A3 | D2 | A2 | D1 | A1 | D0 | A0